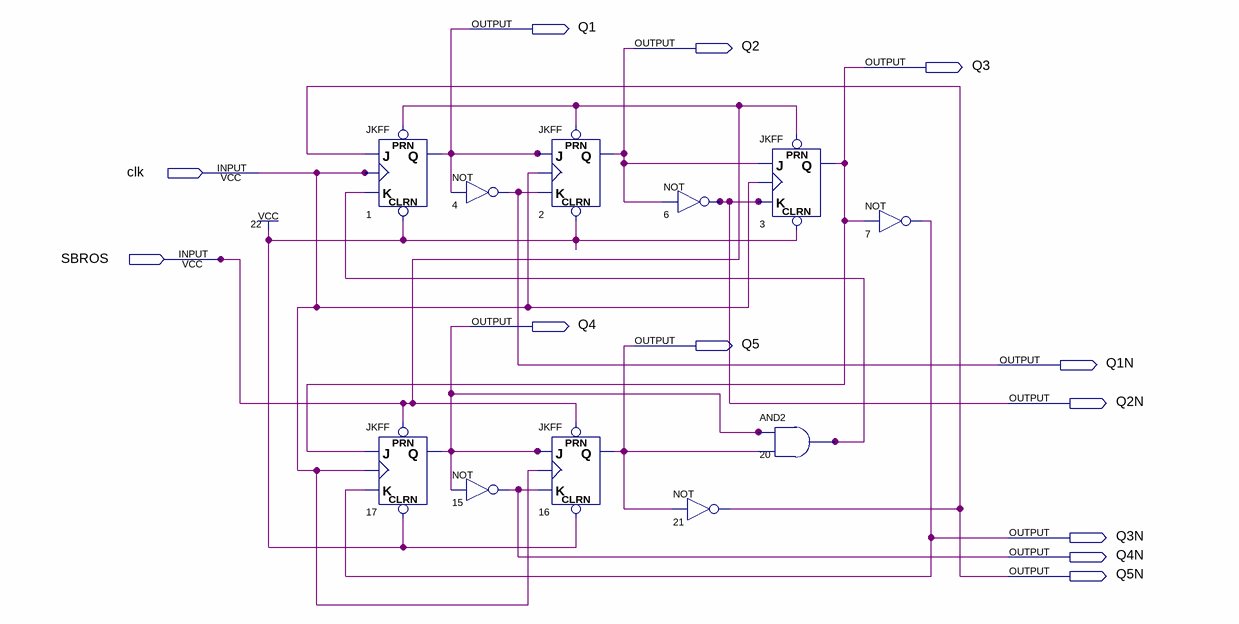
[diagram p0: schematic sheet]
// Quartus schematic count10djon13okt.bdf as structural Verilog: 11 symbols, 12 pins
module count10djon13okt (
  input  clk,
  input  SBROS,
  output Q1,
  output Q2,
  output Q3,
  output Q4,
  output Q5,
  output Q1N,
  output Q2N,
  output Q3N,
  output Q4N,
  output Q5N
);

  wire n20_out;

  JKFF u_1 (.PRN(SBROS), .CLRN(1'b1), .K(n20_out), .J(Q5N), .CLK(clk), .Q(Q1));
  JKFF u_17 (.PRN(SBROS), .CLRN(1'b1), .K(Q3N), .J(Q3), .CLK(clk), .Q(Q4));
  not u_4 (Q1N, Q1);
  not u_15 (Q4N, Q4);
  JKFF u_2 (.PRN(SBROS), .CLRN(1'b1), .K(Q1N), .J(Q1), .CLK(clk), .Q(Q2));
  JKFF u_16 (.PRN(SBROS), .CLRN(1'b1), .K(Q4N), .J(Q4), .CLK(clk), .Q(Q5));
  not u_6 (Q2N, Q2);
  not u_21 (Q5N, Q5);
  JKFF u_3 (.PRN(SBROS), .CLRN(1'b1), .K(Q2N), .J(Q2), .CLK(clk), .Q(Q3));
  and u_20 (n20_out, Q4, Q5);
  not u_7 (Q3N, Q3);
endmodule
